# Altium project Ilk Proje.PrjPcb (part 3 of 3)

## Sheet Sensor Board.SchDoc: Wireless Security
size A3; Date: 30.06.2023; CompanyName: Freelance; Engineer: Berke Tırpan; SheetNumber: 5; SheetTotal: 5; PageSize: A3
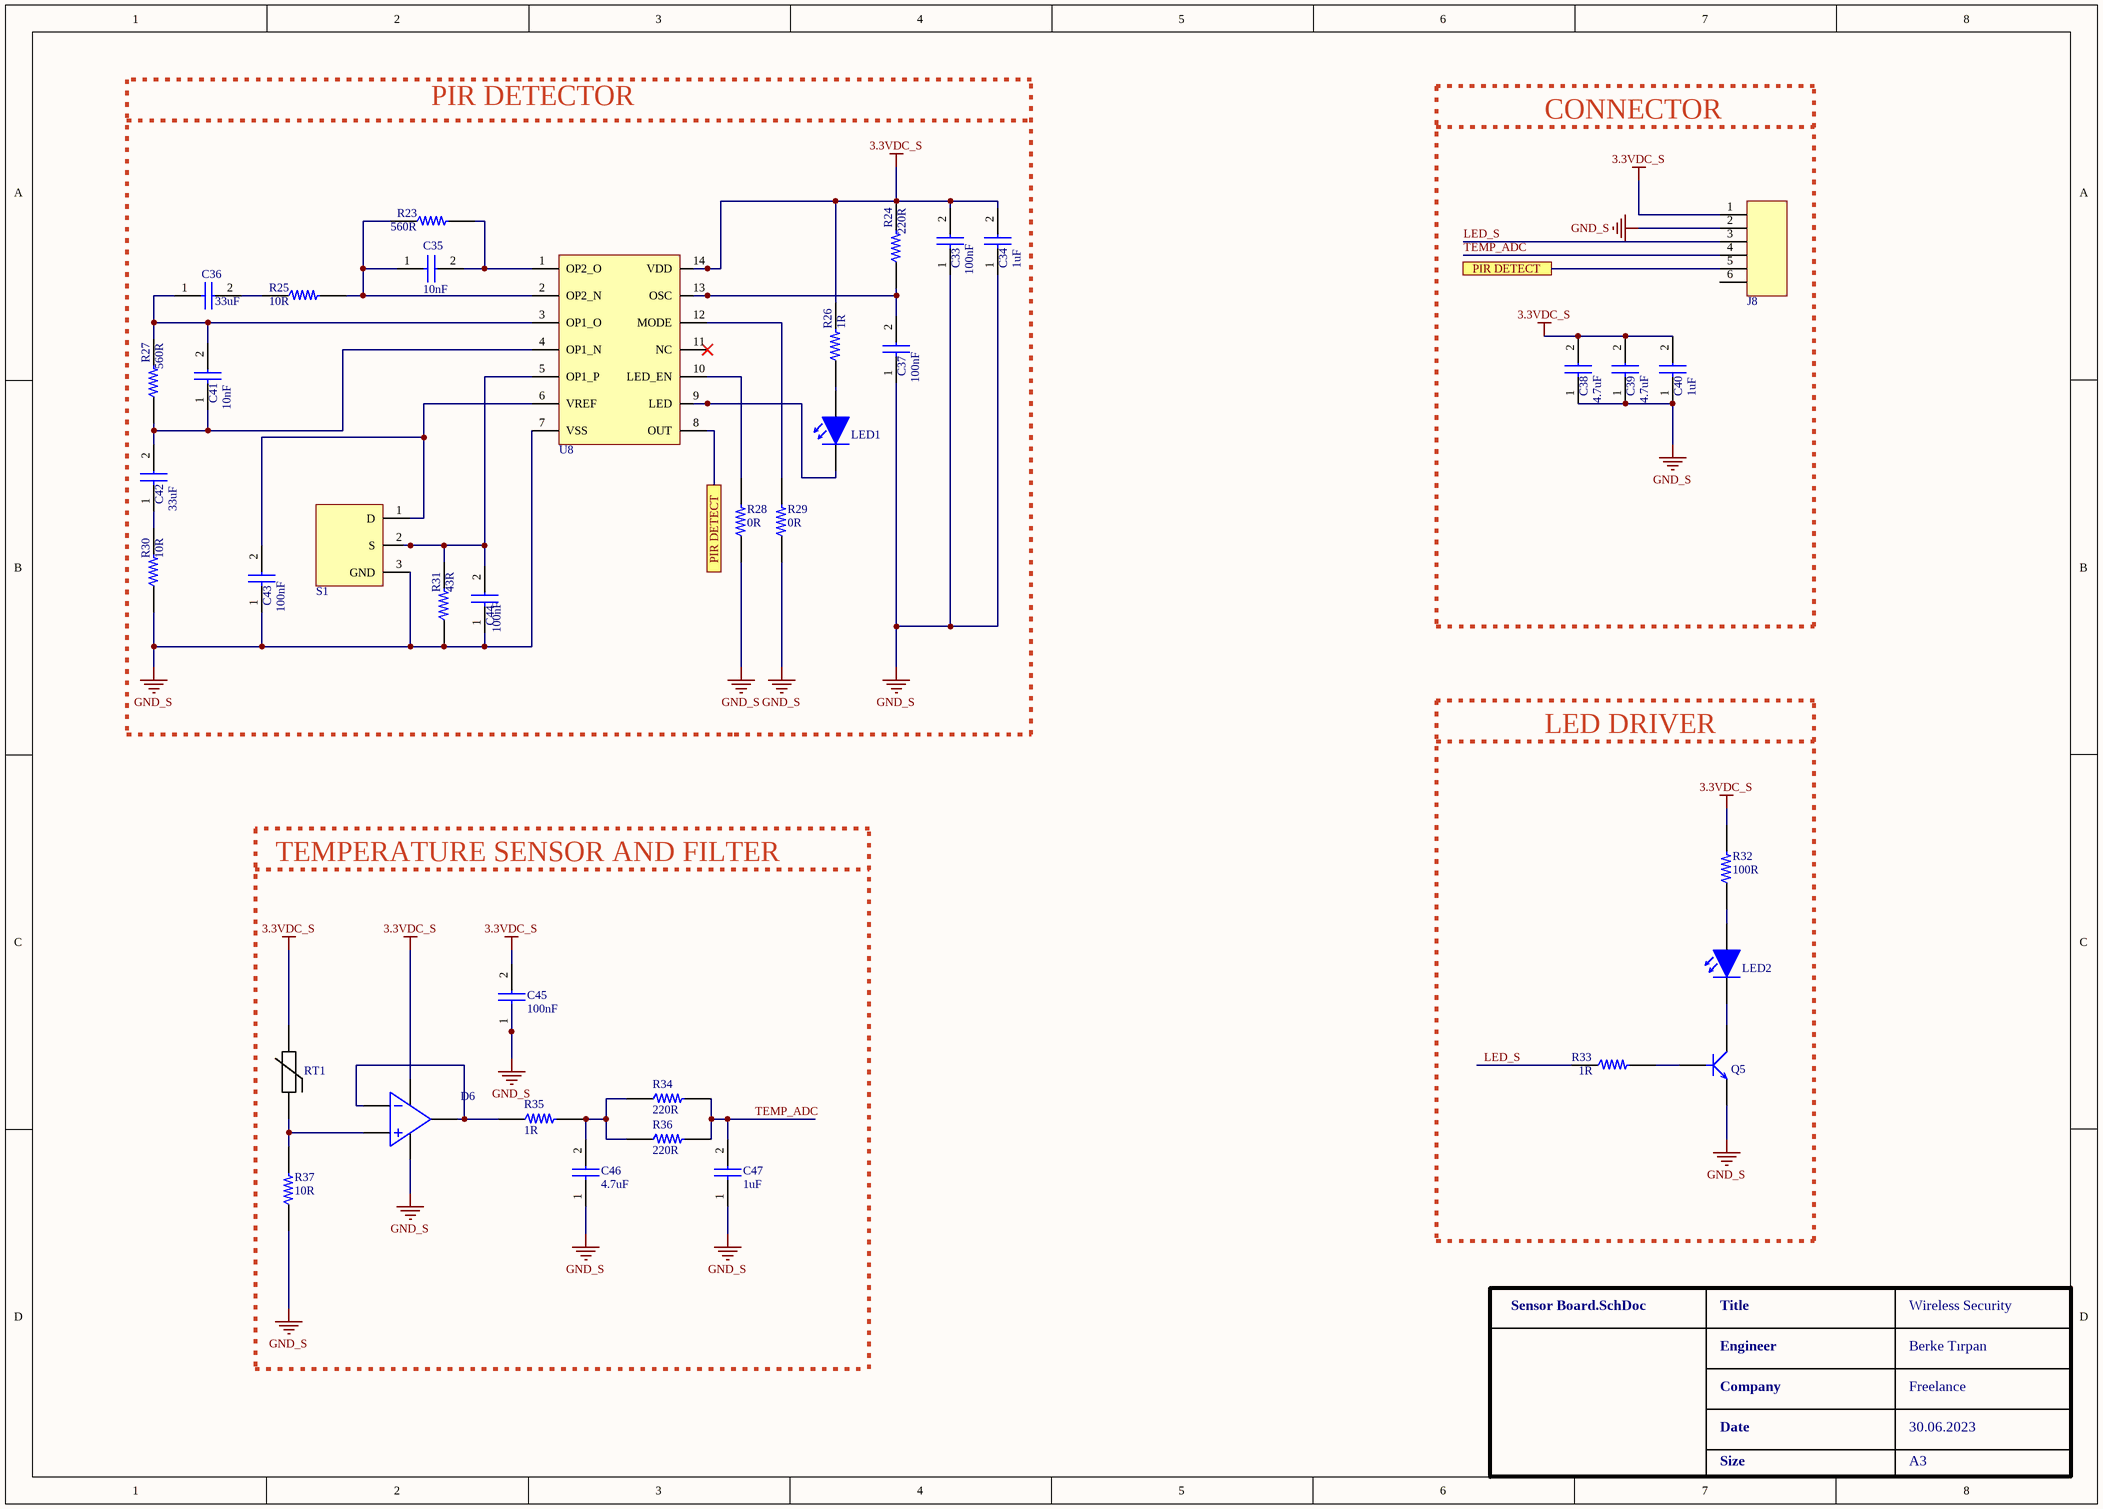
[diagram p4: Sensor Board.SchDoc]

### Parts
C33  Capacitance: 100nF  [CAP_0603]  (hidden comment: C0603C104K5RACTU)
C34  Capacitance: 1uF  [CAP_0805]  (hidden comment: CAP CER 1uF 0805)
C35  Capacitance: 10nF  [CAP_0603]  (hidden comment: CAP CER 10nF 0603)
C36  Capacitance: 33uF  [CAP_1206]  (hidden comment: C3216X5R1E336M160AC)
C37  Capacitance: 100nF  [CAP_0603]  (hidden comment: C0603C104K5RACTU)
C38  Capacitance: 4.7uF  [CAP_0805]  (hidden comment: CAP_CER_4,7UF_0805)
C39  Capacitance: 4.7uF  [CAP_0805]  (hidden comment: CAP_CER_4,7UF_0805)
C40  Capacitance: 1uF  [CAP_0805]  (hidden comment: CAP CER 1uF 0805)
C41  Capacitance: 10nF  [CAP_0603]  (hidden comment: CAP CER 10nF 0603)
C42  Capacitance: 33uF  [CAP_1206]  (hidden comment: C3216X5R1E336M160AC)
C43  Capacitance: 100nF  [CAP_0603]  (hidden comment: C0603C104K5RACTU)
C44  Capacitance: 100nF  [CAP_0603]  (hidden comment: C0603C104K5RACTU)
C45  Capacitance: 100nF  [CAP_0603]  (hidden comment: C0603C104K5RACTU)
C46  Capacitance: 4.7uF  [CAP_0805]  (hidden comment: CAP_CER_4,7UF_0805)
C47  Capacitance: 1uF  [CAP_0805]  (hidden comment: CAP CER 1uF 0805)
D6  OPA314AIDBVR  [SOT23-5]  (value not drawn)
J8  64800611622  [64800611622]  (value not drawn)
LED1  LTST-C171GKT  [LED_GREEN_0805]  (value not drawn)
LED2  LH R974-LP1  [LED_RED_0805]  (value not drawn)
Q5  MMBT3904-7-F  [SOT23-F]  (value not drawn)
R23  Resistance: 560R  [RES_0603]  (hidden comment: RC0603JR-07560KL)
R24  Resistance: 220R  [RES_0603]  (hidden comment: RC0603JR-07220KL)
R25  Resistance: 10R  [RES_0603]  (hidden comment: RC0603FR-0710KL)
R26  Resistance: 1R  [RES_0603]  (hidden comment: RT0603BRD071KL)
R27  Resistance: 560R  [RES_0603]  (hidden comment: RC0603JR-07560KL)
R28  Resistance: 0R  [RES_0603]  (hidden comment: RC0603JR-070RL)
R29  Resistance: 0R  [RES_0603]  (hidden comment: RC0603JR-070RL)
R30  Resistance: 10R  [RES_0603]  (hidden comment: RC0603FR-0710KL)
R31  Resistance: 43R  [RES_0603]  (hidden comment: RC0603JR-0743KL)
R32  Resistance: 100R  [RES_0603]  (hidden comment: RC0603FR-07100KL)
R33  Resistance: 1R  [RES_0603]  (hidden comment: RT0603BRD071KL)
R34  Resistance: 220R  [RES_0603]  (hidden comment: RC0603JR-07220KL)
R35  Resistance: 1R  [RES_0603]  (hidden comment: RT0603BRD071KL)
R36  Resistance: 220R  [RES_0603]  (hidden comment: RC0603JR-07220KL)
R37  Resistance: 10R  [RES_0603]  (hidden comment: RC0603FR-0710KL)
RT1  TFPT1206L1002FM  [RES_1206]  (value not drawn)
S1  LHI 878/3902  [LHI 878]  (value not drawn)
U8  NCS36000DRG  [SOIC14]  (value not drawn)

### Blocks framed on the sheet
PIR DETECTOR: C33-C37 C41-C44 LED1 R23-R31 S1 U8
CONNECTOR: C38-C40 J8
LED DRIVER: LED2 Q5 R32 R33

### Ports
PIR DETECT (see Sensor Board[3B]), PIR DETECT (see Sensor Board[6A])

### Nets
3.3VDC_S: C33.2 C34.2 C38.2 C39.2 C40.2 C45.2 D6.5 J8.1 R24.2 R26.2 R32.2 RT1.2 U8.14(VDD)
GND_S: C33.1 C34.1 C37.1 C38.1 C39.1 C40.1 C43.1 C44.1 C45.1 C46.1 C47.1 D6.2 J8.2 Q5.2(E) R28.1 R29.1 R30.1 R31.1 R37.1 S1.3(GND) U8.7(VSS)
LED_S: J8.3 R33.1
TEMP_ADC: C47.2 J8.4 R34.2 R36.2
NetC35_1: C35.1 R23.1 R25.2 U8.2(OP2_N)
NetC35_2: C35.2 R23.2 U8.1(OP2_O)
NetC36_1: C36.1 C41.2 R27.2 U8.3(OP1_O)
NetC36_2: C36.2 R25.1
NetC37_2: C37.2 R24.1 U8.13(OSC)
NetC41_1: C41.1 C42.2 R27.1 U8.4(OP1_N)
NetC42_1: C42.1 R30.2
NetC43_2: C43.2 S1.1(D) U8.6(VREF)
NetC44_2: C44.2 R31.2 S1.2(S) U8.5(OP1_P)
NetC46_2: C46.2 R34.1 R35.2 R36.1
NetD6_1: D6.1 D6.4 R35.1
NetD6_3: D6.3 R37.2 RT1.1
NetJ8_5: J8.5 U8.8(OUT) ; port PIR DETECT
NetLED1_1: LED1.1 U8.9(LED)
NetLED1_2: LED1.2 R26.1
NetLED2_1: LED2.1 Q5.3(C)
NetLED2_2: LED2.2 R32.1
NetQ5_1: Q5.1(B) R33.2
NetR28_2: R28.2 U8.10(LED_EN)
NetR29_2: R29.2 U8.12(MODE)

Not connected (* = marked no-connect by the designer): J8 6; U8 11(NC)*

### Notes on the sheet
- TEMPERATURE SENSOR AND FILTER
- Title
- Engineer
- Company
- Date
- Size

### Library data of the parts
C33 C37 C43-C45 = CAP CER 100nF 0603: Multilayer Ceramic Capacitors (MLCC) - SMD/SMT 50volts 0.1uF X7R 10%; Manufacturer: KEMET; Voltage: 50V; Desinged by: BERKE; Supplier 1: Digi-Key; Manufacturer Part Number: C0603C104K5RACTU; RoHS: Yes; Category: Ceramic Capacitors; Stock 1: 10147790; Pricing 1: 1=0,11, 10=0,078, 50=0,0424, 100=0,0346, 500=0,02474, 1000=0,01944 (USD); Mount: Surface Mount; Case/Package: 0603; Min Operating Temperature: -55°C; Max Operating Temperature: 125°C; Tolerance: 10%; Packaging: Tape and Reel; Dielectric: X7R; Series: SMD Comm X7R; Voltage Rating: 50V; Length: 0.063inch; Width: 0.031inch; Thickness: 0.034inch; RoHS Compliant: Yes; Supplier Part Number 1: 399-C0603C104K5RAC7867CT-ND
C34 C40 C47 = CAP CER 1uF 0805: CAP CER 1UF 50V X7R %10 0805; Manufacturer: Samsung; Manufacturer Part Number: CL21B105KBFNNNE; Desinged by: BERKE; Tolerance: 10%; Supplier 1: Digi-Key; RoHS: Yes; Category: Ceramic Capacitors; Stock 1: 84626; Pricing 1: 1=0,11, 10=0,079, 50=0,045, 100=0,0373, 500=0,02616, 1000=0,02165 (USD); Mount: Surface Mount; Case/Package: 0805; Case Code (Metric): 2012; Case Code (Imperial): 0805; Min Operating Temperature: -55°C; Max Operating Temperature: 125°C; Packaging: Tape and Reel; Package Quantity: 1; Voltage Rating: 50V; Dielectric: X7R; Voltage: 50V; Series: CL; Construction: Flat; Length: 2mm; Width: 0.049inch; Height: 1.25mm; Thickness: 0.053inch; Depth: 1.25mm; Radiation Hardening: No; RoHS Compliant: Yes; ComponentLink1URL: https://datasheet.ciiva.com/25800/cl21b105kbfnnne-25800291.pdf?src-supplier=Digi-Key; ComponentLink1Description: https://datasheet.ciiva.com/25800/cl21b105kbfnnne-25800291.pdf?src-supplier=Digi-Key; Supplier Part Number 1: 1276-1029-1-ND
C35 C41 = CAP CER 10nF 0603: Multilayer Ceramic Capacitor, 0.01 F, 10%, X7R, 16 V, 0603 [1608 Metric] RoHS Compliant: Yes; Manufacturer: Walsin Technologies; Manufacturer Part Number: 0603B103K160CT; Desinged by: BERKE; Voltage Rating: 16V; Supplier 1: Digi-Key; RoHS: Yes; Category: Ceramic Capacitors; Stock 1: 54105; Pricing 1: 1=0,1, 10=0,033, 50=0,0182, 100=0,0148, 500=0,0106, 1000=0,00833 (USD); Case Code (Metric): 1608; Case Code (Imperial): 0603; Min Operating Temperature: -55°C; Max Operating Temperature: 125°C; Tolerance: 10%; Packaging: Tape and Reel; Dielectric: X7R; Voltage Rating (DC): 16V; RoHS Compliant: Yes; Reach SVHC Compliant: Unknown; ComponentLink1URL: http://www.farnell.com/datasheets/1958513.pdf?src-supplier=Farnell; ComponentLink1Description: http://www.farnell.com/datasheets/1958513.pdf?src-supplier=Farnell; ComponentLink2URL: http://www.farnell.com/datasheets/1958513.pdf?src-supplier=Element14; ComponentLink2Description: http://www.farnell.com/datasheets/1958513.pdf?src-supplier=Element14; ComponentLink3URL: http://www.passivecomponent.com/wp-content/uploads/2018/10/MLCC.pdf?src-supplier=Digi-Key; ComponentLink3Description: http://www.passivecomponent.com/wp-content/uploads/2018/10/MLCC.pdf?src-supplier=Digi-Key; Supplier Part Number 1: 1292-1384-1-ND
C36 C42 = CAP CER 33uF 1206: C Series 1206 33 uF 25 V ±20 % Tolerance X5R SMT Multilayer Ceramic Capacitor; Manufacturer: TDK; Desinged by: BERKE; Voltage Rating: 25V; Tolerance: 20%; Supplier 1: Digi-Key; Manufacturer Part Number: C3216X5R1E336M160AC; RoHS: Yes; Category: Ceramic Capacitors; Stock 1: 254609; Pricing 1: 1=0,96, 10=0,758, 50=0,6564, 100=0,5681, 500=0,42924, 1000=0,37875 (USD); Mount: Surface Mount; Case/Package: 1206; Case Code (Metric): 3216; Case Code (Imperial): 1206; Weight: 0.000571oz; Dielectric Material: Ceramic; Min Operating Temperature: -55°C; Max Operating Temperature: 85°C; Packaging: Tape and Reel; Termination: SMD/SMT; Series: C; Package Quantity: 1; Voltage Rating (DC): 25V; Dielectric: X5R; Length: 3.2mm; Width: 0.063inch; Depth: 1.6mm; Thickness: 1.6mm; Reach SVHC Compliant: No; Lead Free: Lead Free; RoHS Compliant: Yes; ComponentLink1URL: https://datasheet.ciiva.com/24216/c3216x5r1e336m160ac-265051-24216512.pdf?src-supplier=Mouser; ComponentLink1Description: https://datasheet.ciiva.com/24216/c3216x5r1e336m160ac-265051-24216512.pdf?src-supplier=Mouser; ComponentLink2URL: https://datasheet.ciiva.com/6285/tdkmlcccaprange-6285278.pdf?src-supplier=Digi-Key; ComponentLink2Description: https://datasheet.ciiva.com/6285/tdkmlcccaprange-6285278.pdf?src-supplier=Digi-Key; Supplier Part Number 1: 445-8046-1-ND
C38 C39 C46 = CAP_CER_4,7UF_0805: CAP CER 4.7UF 25V %10 0805; Manufacturer: Samsung; Manufacturer Part Number: CL21A475KAQNNNE; Tolerance: 10%; Dielectric: X5R; Desinged by: BERKE; Supplier 1: Digi-Key; RoHS: Yes; Category: Ceramic Capacitors; Stock 1: 4065249; Pricing 1: 1=0,1, 10=0,073, 50=0,0414, 100=0,0344, 500=0,02408, 1000=0,01994 (USD); Mount: Surface Mount; Case/Package: 0805; Case Code (Metric): 2012; Case Code (Imperial): 0805; Min Operating Temperature: -55°C; Max Operating Temperature: 85°C; Packaging: Tape and Reel; Voltage Rating: 25V; Voltage Rating (DC): 25V; Series: CL; Construction: Flat; Length: 2mm; Height: 1.25mm; Depth: 1.25mm; Radiation Hardening: No; Lead Free: Lead Free; RoHS Compliant: Yes; ComponentLink1URL: https://datasheet.ciiva.com/25798/cl21a475kaqnnne-25798882.pdf?src-supplier=Digi-Key; ComponentLink1Description: https://datasheet.ciiva.com/25798/cl21a475kaqnnne-25798882.pdf?src-supplier=Digi-Key; Supplier Part Number 1: 1276-1244-1-ND
D6 = OPA314: IC OPAMP GP 3MHZ RRO SOT23-5; Manufacturer: Texas Instruments; Min Supply Voltage: 1.8V; Max Supply Voltage: 5.5V; Min Dual Supply Voltage: 900mV; Max Dual Supply Voltage: 2.75V; Voltage Gain: 128dB; Common Mode Rejection Ratio: 75dB; Output Current: 20mA; Number of Channels: 1; Slew Rate: 1.5V/µs; Max I/O Voltage: 2.5mV; Input Bias Current: 10pA; Operating Supply Current: 150uA; Power Supply Rejection Ratio (PSRR): 78dB; Amplifier Type: GENERAL PURPOSE; Desinged by: BERKE; Supplier 1: Digi-Key; Manufacturer Part Number: OPA314AIDBVR; RoHS: Yes; Category: Amplifiers - Op Amps, Buffer, Instrumentation; Stock 1: 1044; Pricing 1: 1=1,18, 10=1,054, 25=1,0008, 100=0,822, 250=0,76844, 500=0,67908, 1000=0,53612 (USD); Case/Package: SOT-23-5; Number of Pins: 5; Min Operating Temperature: -40°C; Max Operating Temperature: 125°C; Gain Bandwidth Product: 3MHz; Package Quantity: 1; Packaging: Tape and Reel; Unity Gain Bandwidth Product: 3MHz; Nominal Gain Bandwidth Product: 3MHz; Input Offset Voltage (Vos): 2.5mV; Number of Circuits: 1; Output Current per Channel: 20mA; Number of Elements: 1; Supply Current: 150uA; Series: -; Technology: CMOS; Radiation Hardening: No; Lead Free: Lead Free; RoHS Compliant: Yes; ComponentLink1URL: https://datasheet.ciiva.com/29638/opa314-29638827.pdf?src-supplier=Digi-Key; ComponentLink1Description: https://datasheet.ciiva.com/29638/opa314-29638827.pdf?src-supplier=Digi-Key; ComponentLink2URL: https://datasheet.ciiva.com/14462/opa2314-14462006.pdf?src-supplier=Avnet; ComponentLink2Description: https://datasheet.ciiva.com/14462/opa2314-14462006.pdf?src-supplier=Avnet; ComponentLink3URL: https://datasheet.ciiva.com/14456/opa2314-14456281.pdf?src-supplier=Avnet; ComponentLink3Description: https://datasheet.ciiva.com/14456/opa2314-14456281.pdf?src-supplier=Avnet; Supplier Part Number 1: 296-36699-1-ND
J8 = 64800611622_conn_6pin: WR-WTB Wire-to-Board Connectors 6PIN 1.50 mm; Manufacturer: Wurth Electronics; Desinged by: BERKE; Supplier 1: Digi-Key; Manufacturer Part Number: 64800611622; RoHS: No; Category: Uncategorized; Stock 1: 929; Pricing 1: 1=0,42, 50=0,406, 100=0,384, 250=0,361, 500=0,339 (USD); Supplier Part Number 1: 732-64800611622-ND
LED1 = LED GREEN 0805: Green 569nm LED Indication - Discrete 2.1V 0805 (2012 Metric); Manufacturer: Vishay Lite-On; Lens Color: Colorless; Viewing Angle: 130°; Lens Style: Flat,Diffused,Colorless,Rectangular,Clear; Luminous Intensity: 12mcd; Forward Current: 30mA; Power Rating: 100mW; Test Current: 10mA; Lens Transparency: Clear; Number of Elements: 1; Wavelength: 585nm; Reverse Voltage: 5V; Lens Size: 1.25mm; Desinged by: BERKE; Supplier 1: Digi-Key; Manufacturer Part Number: LTST-C171GKT; RoHS: Yes; Category: LEDs; Stock 1: 207659; Pricing 1: 1=0,26, 10=0,143, 100=0,0663, 500=0,0612, 1000=0,04794 (USD); Mount: Surface Mount; Case/Package: 0805; Number of Pins: 2; Color: Green; Case Code (Metric): 2012; Case Code (Imperial): 0805; Min Operating Temperature: -55°C; Max Operating Temperature: 85°C; Package Quantity: 3000; Packaging: Tape and Reel; Forward Voltage: 2.1V; Illumination Color: Green; Dominant Wavelength: 569nm; Power Dissipation: 100mW; Number of LEDs: 1; Series: -; Length: 2mm; Width: 1.25mm; Height: 0.9mm; Depth: 1.25mm; Radiation Hardening: No; Lead Free: Lead Free; RoHS Compliant: Yes; ComponentLink1URL: https://datasheet.ciiva.com/11773/0900766b80dc0296-11773991.pdf?src-supplier=Rs; ComponentLink1Description: https://datasheet.ciiva.com/11773/0900766b80dc0296-11773991.pdf?src-supplier=Rs; ComponentLink2URL: https://datasheet.ciiva.com/2110/ltst-c171gkt-2110000.pdf?src-supplier=Digi-Key; ComponentLink2Description: https://datasheet.ciiva.com/2110/ltst-c171gkt-2110000.pdf?src-supplier=Digi-Key; ComponentLink3URL: https://datasheet.ciiva.com/12400/lite-on-ltst-c171gkt-190133-12400647.pdf?src-supplier=Mouser; ComponentLink3Description: https://datasheet.ciiva.com/12400/lite-on-ltst-c171gkt-190133-12400647.pdf?src-supplier=Mouser; ComponentLink4URL: https://datasheet.ciiva.com/2110/ltst-c171gkt-2110001.pdf?src-supplier=Digi-Key; ComponentLink4Description: https://datasheet.ciiva.com/2110/ltst-c171gkt-2110001.pdf?src-supplier=Digi-Key; ComponentLink5URL: https://datasheet.ciiva.com/2110/ltst-c171gkt-2110002.pdf?src-supplier=Digi-Key; ComponentLink5Description: https://datasheet.ciiva.com/2110/ltst-c171gkt-2110002.pdf?src-supplier=Digi-Key; ComponentLink6URL: https://datasheet.ciiva.com/16396/ltst-c171gkt-16396549.pdf?src-supplier=Future+Electronics; ComponentLink6Description: https://datasheet.ciiva.com/16396/ltst-c171gkt-16396549.pdf?src-supplier=Future+Electronics; Supplier Part Number 1: 160-1423-1-ND
LED2 = LED RED 0805: LED Uni-Color Hyper Red 660nm 2-Pin Chip 0805(2012Metric) T/R; Mfr: ams-OSRAN USA INC.; Desinged by: BERKE; Lens Transparency: Diffused; Lens Color: White; Configuration: Standard; Product Status: Obsolete; Base Product Number: LHR974; Wavelength - Dominant: 645nm; Viewing Angle: 160; Current - Test: 20mA; Millicandela Rating: 41mcd; Lens Style: Rectangle with Flat Top; Lens Size: 1.30mm x 1.25mm; Voltage - Forward (Vf) (Typ): 1.8V; Color: Red; Package: Tape & Reel (TR); Series: CHIPLED 0805; Height (Max): 0.90mm; Size / Dimension: 2.00mm L x 1.25mm W; Supplier Device Package: 0805; Package / Case: 0805 (2012 Metric); Features: -; Wavelength - Peak: 660nm; Mounting Type: Surface Mount
Q5 = MMBT3904-7-F: NPN Ic=200mA Vceo=40V hfe=100~300 fT=310MHz P=300mW SOT-23; Manufacturer: Diodes Zetex; Desinged by: BERKE; Max Power Dissipation: 300mW; Collector Emitter Voltage (VCEO): 40V; Max Collector Current: 200mA; Collector Base Voltage (VCBO): 60V; Power Dissipation: 350mW; Frequency: 300MHz; hFE Min: 100; Number of Elements: 1; Emitter Base Voltage (VEBO): 6V; Collector Emitter Saturation Voltage: 300mV; Supplier 1: Digi-Key; Manufacturer Part Number: MMBT3904-7-F; RoHS: Yes; Category: BJTs; Stock 1: 6383011; Pricing 1: 1=0,12, 10=0,11, 100=0,0601, 500=0,03696, 1000=0,0252 (USD); Mount: Surface Mount; Case/Package: SOT-23; Number of Pins: 3; Weight: 0.000282oz; Min Operating Temperature: -55°C; Max Operating Temperature: 150°C; Polarity: NPN; Packaging: Tape and Reel; Package Quantity: 3000; Transition Frequency: 300MHz; Collector Emitter Breakdown Voltage: 40V; Max Breakdown Voltage: 40V; Continuous Collector Current: 200mA; Max Frequency: 300MHz; Gain Bandwidth Product: 300MHz; Voltage Rating (DC): 40V; Series: Automotive, AEC-Q101; Collector-emitter Voltage-Max: 300mV; Length: 3.05mm; Width: 1.4mm; Height: 1mm; Radiation Hardening: No; Reach SVHC Compliant: No; Lead Free: Lead Free; RoHS Compliant: Yes; ComponentLink1URL: https://datasheet.ciiva.com/11201/ds30036-11201778.pdf?src-supplier=Avnet; ComponentLink1Description: https://datasheet.ciiva.com/11201/ds30036-11201778.pdf?src-supplier=Avnet; ComponentLink2URL: https://datasheet.ciiva.com/15138/getdatasheetpartid-53265-15138780.pdf?src-supplier=Verical; ComponentLink2Description: https://datasheet.ciiva.com/15138/getdatasheetpartid-53265-15138780.pdf?src-supplier=Verical; ComponentLink3URL: https://datasheet.ciiva.com/22711/1915516-22711750.pdf?src-supplier=Element14; ComponentLink3Description: https://datasheet.ciiva.com/22711/1915516-22711750.pdf?src-supplier=Element14; ComponentLink4URL: https://datasheet.ciiva.com/11198/ds30036-11198999.pdf?src-supplier=Avnet; ComponentLink4Description: https://datasheet.ciiva.com/11198/ds30036-11198999.pdf?src-supplier=Avnet; ComponentLink5URL: https://datasheet.ciiva.com/6361/ds30036-6361256.pdf?src-supplier=Digi-Key; ComponentLink5Description: https://datasheet.ciiva.com/6361/ds30036-6361256.pdf?src-supplier=Digi-Key; ComponentLink6URL: https://datasheet.ciiva.com/6361/ds30036-6361254.pdf?src-supplier=Digi-Key; ComponentLink6Description: https://datasheet.ciiva.com/6361/ds30036-6361254.pdf?src-supplier=Digi-Key; Supplier Part Number 1: MMBT3904-FDICT-ND
R23 R27 = RES 560K OHM 0603: Res Thick Film 0603 560K Ohm 5% 0.1W(1/10W) ±100ppm/C Molded SMD Paper T/R; Manufacturer: Yageo; Desinged by: BERKE; Power Rating: 100mW; Voltage Rating: 75V; Voltage Rating (DC): 50V; Temperature Coefficient: 100ppm/°C; Supplier 1: Digi-Key; Manufacturer Part Number: RC0603JR-07560KL; RoHS: Yes; Category: Chip SMD Resistors; Stock 1: 503311; Pricing 1: 1=0,1, 10=0,014, 50=0,0088, 100=0,0073, 500=0,00486, 1000=0,00415 (USD); Case/Package: 0603; Number of Pins: 2; Case Code (Metric): 1608; Case Code (Imperial): 0603; Weight: 7.1E-05oz; Min Operating Temperature: -55°C; Max Operating Temperature: 155°C; Package Quantity: 1; Tolerance: 5%; Packaging: Tape and Reel; Resistor Type: Thick Film; Number of Terminations: 2; Termination: SMD/SMT; Max Power Dissipation: 100mW; Working Voltage: 75V; Features: Moisture Resistant; Series: RC; Resistance Tolerance: 5%; Technology: THICK FILM; Length: 0.063inch; Width: 0.8mm; Height: 0.022inch; Lead Free: Lead Free; RoHS Compliant: Yes; Reach SVHC Compliant: Unknown; ComponentLink1URL: https://datasheet.ciiva.com/2453/pyu-r-int-thick-7-2453056.pdf?src-supplier=Digi-Key; ComponentLink1Description: https://datasheet.ciiva.com/2453/pyu-r-int-thick-7-2453056.pdf?src-supplier=Digi-Key; ComponentLink2URL: https://datasheet.ciiva.com/2453/pyu-r-int-thick-7-2453057.pdf?src-supplier=Digi-Key; ComponentLink2Description: https://datasheet.ciiva.com/2453/pyu-r-int-thick-7-2453057.pdf?src-supplier=Digi-Key; ComponentLink3URL: https://datasheet.ciiva.com/2453/pyu-r-int-thick-7-2453055.pdf?src-supplier=Digi-Key; ComponentLink3Description: https://datasheet.ciiva.com/2453/pyu-r-int-thick-7-2453055.pdf?src-supplier=Digi-Key; Supplier Part Number 1: 311-560KGRCT-ND
R24 R34 R36 = RES 220K OHM 0603: Res Thick Film 0603 220K Ohm 5% 0.1W(1/10W) ±100ppm/C Pad SMD T/R; Manufacturer: Yageo; Desinged by: BERKE; Temperature Coefficient: 100ppm/°C; Voltage Rating (DC): 50V; Power Rating: 100mW; Supplier 1: Digi-Key; Manufacturer Part Number: RC0603JR-07220KL; RoHS: Yes; Category: Chip SMD Resistors; Stock 1: 1082518; Pricing 1: 1=0,1, 10=0,014, 50=0,0088, 100=0,0073, 500=0,00486, 1000=0,00415 (USD); Case/Package: 0603; Number of Pins: 2; Case Code (Imperial): 0603; Case Code (Metric): 1608; Size Code: 0603; Min Operating Temperature: -55°C; Max Operating Temperature: 155°C; Resistor Type: Thick Film; Tolerance: 5%; Packaging: Tape and Reel; Voltage Rating: 50V; Package Quantity: 1; Termination: SMD/SMT; Number of Terminations: 2; Max Power Dissipation: 100mW; Features: Moisture Resistant; Series: RC; Construction: Rectangular; Resistance Tolerance: 5%; Length: 0.063inch; Width: 0.031inch; Height: 0.022inch; Depth: 0.8mm; Reach SVHC Compliant: No; Lead Free: Lead Free; RoHS Compliant: Yes; Military Standard: Not; ComponentLink1URL: https://datasheet.ciiva.com/2452/pyu-r-int-thick-7-2452925.pdf?src-supplier=Digi-Key; ComponentLink1Description: https://datasheet.ciiva.com/2452/pyu-r-int-thick-7-2452925.pdf?src-supplier=Digi-Key; ComponentLink2URL: https://datasheet.ciiva.com/2452/pyu-r-int-thick-7-2452923.pdf?src-supplier=Digi-Key; ComponentLink2Description: https://datasheet.ciiva.com/2452/pyu-r-int-thick-7-2452923.pdf?src-supplier=Digi-Key; ComponentLink3URL: https://datasheet.ciiva.com/2452/pyu-r-int-thick-7-2452924.pdf?src-supplier=Digi-Key; ComponentLink3Description: https://datasheet.ciiva.com/2452/pyu-r-int-thick-7-2452924.pdf?src-supplier=Digi-Key; Supplier Part Number 1: 311-220KGRCT-ND
R25 R30 R37 = RES 10K OHM 0603: RES SMD 10K OHM 1% 1/10W 0603; Manufacturer: Yageo; Temperature Coefficient: 100ppm/°C; Voltage Rating (DC): 50V; Power Rating: 100mW; Voltage Rating: 75V; Desinged by: BERKE; Supplier 1: Digi-Key; Manufacturer Part Number: RC0603FR-0710KL; RoHS: Yes; Category: Chip SMD Resistors; Stock 1: 31631181; Pricing 1: 1=0,1, 10=0,019, 50=0,0114, 100=0,0094, 500=0,00628, 1000=0,00537 (USD); Case/Package: 0603; Number of Pins: 2; Case Code (Imperial): 0603; Case Code (Metric): 1608; Weight: 7.1E-05oz; Size Code: 0603; Min Operating Temperature: -55°C; Max Operating Temperature: 155°C; Tolerance: 1%; Resistor Type: Thick Film; Packaging: Tape and Reel; Termination: SMD/SMT; Features: Moisture Resistant; Series: RC; Max Power Dissipation: 100mW; Number of Terminations: 2; Resistance Tolerance: 1%; Construction: Rectangular; Length: 1.6mm; Width: 0.8mm; Height: 0.45mm; Depth: 0.8mm; Lead Pitch: 0.3mm; Reach SVHC Compliant: No; Lead Free: Lead Free; Military Standard: Not; RoHS Compliant: Yes; ComponentLink1URL: https://datasheet.ciiva.com/7660/38590-7660789.pdf?src-supplier=Element14; ComponentLink1Description: https://datasheet.ciiva.com/7660/38590-7660789.pdf?src-supplier=Element14; ComponentLink2URL: https://datasheet.ciiva.com/7983/443971-7983596.pdf?src-supplier=Element14; ComponentLink2Description: https://datasheet.ciiva.com/7983/443971-7983596.pdf?src-supplier=Element14; ComponentLink3URL: https://datasheet.ciiva.com/22747/443971-22747519.pdf?src-supplier=Element14; ComponentLink3Description: https://datasheet.ciiva.com/22747/443971-22747519.pdf?src-supplier=Element14; ComponentLink4URL: https://datasheet.ciiva.com/46440/1868787-46440891.pdf?src-supplier=Element14; ComponentLink4Description: https://datasheet.ciiva.com/46440/1868787-46440891.pdf?src-supplier=Element14; ComponentLink5URL: https://datasheet.ciiva.com/7746/1738695-7746239.pdf?src-supplier=Element14; ComponentLink5Description: https://datasheet.ciiva.com/7746/1738695-7746239.pdf?src-supplier=Element14; ComponentLink6URL: https://datasheet.ciiva.com/15189/getdatasheetpartid-409289-15189591.pdf?src-supplier=Verical; ComponentLink6Description: https://datasheet.ciiva.com/15189/getdatasheetpartid-409289-15189591.pdf?src-supplier=Verical; Supplier Part Number 1: 311-10.0KHRCT-ND
R26 R33 R35 = RES 1K OHM 0603: High Precision-High Stability Chip Resistor Thin Film 0603 1kOhm 0.1% Paper T/R; Manufacturer: Yageo; Desinged by: BERKE; Power Rating: 100mW; Voltage Rating: 75V; Temperature Coefficient: 25ppm/°C; Voltage Rating (DC): 50V; Supplier 1: Digi-Key; Manufacturer Part Number: RT0603BRD071KL; RoHS: Yes; Category: Chip SMD Resistors; Stock 1: 114977; Pricing 1: 1=0,34, 10=0,288, 100=0,1126, 500=0,06812, 1000=0,04716, 2500=0,04322 (USD); Mount: Surface Mount; Case/Package: 0603; Case Code (Metric): 1608; Case Code (Imperial): 0603; Contact Plating: Tin,Lead; Size Code: 0603; Min Operating Temperature: -55°C; Max Operating Temperature: 155°C; Package Quantity: 5000; Packaging: Tape and Reel; Termination: SMD/SMT; Series: RT; Technology: THIN FILM; Number of Terminations: 2; Max Power Dissipation: 100mW; Features: Moisture Resistant; Length: 0.063inch; Width: 0.031inch; Height: 0.022inch; Depth: 0.8mm; RoHS Compliant: Yes; Lead Free: Lead Free; ComponentLink1URL: https://datasheet.ciiva.com/5624/pyu-rt-1-to-0-05-rohs-l-4-5624759.pdf?src-supplier=Mouser; ComponentLink1Description: https://datasheet.ciiva.com/5624/pyu-rt-1-to-0-05-rohs-l-4-5624759.pdf?src-supplier=Mouser; ComponentLink2URL: https://datasheet.ciiva.com/29718/pyu-rt-1-to-0-05-rohs-l-4-29718010.pdf?src-supplier=Digi-Key; ComponentLink2Description: https://datasheet.ciiva.com/29718/pyu-rt-1-to-0-05-rohs-l-4-29718010.pdf?src-supplier=Digi-Key; Supplier Part Number 1: YAG1237CT-ND
R28 R29 = RES 0 OHM 0603: RES SMD 0 OHM JUMPER 1/10W 0603; Manufacturer: Yageo; Tolerance: 1%; Power Rating: 100mW; Voltage Rating (DC): 50V; Temperature Coefficient: 200ppm/°C; Resistance Tolerance: 5%; Desinged by: BERKE; Supplier 1: Digi-Key; Manufacturer Part Number: RC0603JR-070RL; RoHS: Yes; Category: Chip SMD Resistors; Stock 1: 7452176; Pricing 1: 1=0,1, 10=0,016, 25=0,0112, 50=0,0086, 100=0,0063, 250=0,0048, 500=0,00386, 1000=0,00284 (USD); Case/Package: 0603; Number of Pins: 2; Contact Plating: Tin,Matte; Case Code (Imperial): 0603; Case Code (Metric): 1608; Size Code: 0603; Min Operating Temperature: -55°C; Resistor Type: Thick Film; Packaging: Tape and Reel; Termination: SMD/SMT; Series: RC; Technology: THICK FILM; Package Quantity: 5000; Voltage Rating: 50V; Features: Moisture Resistant; Max Power Dissipation: 100mW; Number of Terminations: 2; Construction: Rectangular; Length: 1.6mm; Width: 0.8mm; Height: 0.45mm; Depth: 0.8mm; Lead Free: Lead Free; RoHS Compliant: Yes; Reach SVHC Compliant: Unknown; Military Standard: Not; Supplier Part Number 1: 311-0.0GRCT-ND; Max Operating Temperature: 155°C
R31 = RES 43K OHM 0603: Res Thick Film 0603 43K Ohm 5% 0.1W(1/10W) ±100ppm/°C Pad SMD T/R; Manufacturer: Yageo; Desinged by: BERKE; Voltage Rating: 75V; Power Rating: 100mW; Voltage Rating (DC): 50V; Supplier 1: Digi-Key; Manufacturer Part Number: RC0603JR-0743KL; RoHS: Yes; Category: Chip SMD Resistors; Stock 1: 306498; Pricing 1: 1=0,1, 10=0,014, 50=0,0088, 100=0,0073, 500=0,00486, 1000=0,00415 (USD); Case/Package: 0603; Case Code (Imperial): 0603; Case Code (Metric): 1608; Weight: 7.1E-05oz; Min Operating Temperature: -55°C; Max Operating Temperature: 155°C; Tolerance: 5%; Packaging: Tape and Reel; Package Quantity: 1; Termination: SMD/SMT; Number of Terminations: 2; Temperature Coefficient: 100ppm/°C; Max Power Dissipation: 100mW; Working Voltage: 75V; Features: Moisture Resistant; Series: RC; Technology: THICK FILM; Length: 0.063inch; Width: 0.031inch; Height: 0.022inch; Lead Free: Lead Free; RoHS Compliant: Yes; ComponentLink1URL: https://datasheet.ciiva.com/2453/pyu-r-int-thick-7-2453053.pdf?src-supplier=Digi-Key; ComponentLink1Description: https://datasheet.ciiva.com/2453/pyu-r-int-thick-7-2453053.pdf?src-supplier=Digi-Key; ComponentLink2URL: https://datasheet.ciiva.com/2453/pyu-r-int-thick-7-2453054.pdf?src-supplier=Digi-Key; ComponentLink2Description: https://datasheet.ciiva.com/2453/pyu-r-int-thick-7-2453054.pdf?src-supplier=Digi-Key; ComponentLink3URL: https://datasheet.ciiva.com/2453/pyu-r-int-thick-7-2453052.pdf?src-supplier=Digi-Key; ComponentLink3Description: https://datasheet.ciiva.com/2453/pyu-r-int-thick-7-2453052.pdf?src-supplier=Digi-Key; Supplier Part Number 1: 311-43KGRCT-ND
R32 = RES 100K OHM 0603: RES SMD 100K OHM 1% 1/10W 0603; Manufacturer: Yageo; Desinged by: BERKE; Temperature Coefficient: 100ppm/°C; Voltage Rating (DC): 50V; Power Rating: 100mW; Supplier 1: Digi-Key; Manufacturer Part Number: RC0603FR-07100KL; RoHS: Yes; Category: Chip SMD Resistors; Stock 1: 6893987; Pricing 1: 1=0,1, 10=0,018, 50=0,0106, 100=0,0088, 500=0,00592, 1000=0,00505 (USD); Case/Package: 0603; Number of Pins: 2; Case Code (Imperial): 0603; Case Code (Metric): 1608; Min Operating Temperature: -55°C; Max Operating Temperature: 155°C; Tolerance: 1%; Resistor Type: Thick Film; Packaging: Tape and Reel; Voltage Rating: 50V; Termination: SMD/SMT; Number of Terminations: 2; Features: Moisture Resistant; Series: RC; Max Power Dissipation: 100mW; Resistance Tolerance: 1%; Construction: Rectangular; Technology: THICK FILM; Length: 1.6mm; Width: 0.8mm; Height: 0.45mm; Depth: 0.8mm; Reach SVHC Compliant: No; Lead Free: Lead Free; Military Standard: Not; RoHS Compliant: Yes; Supplier Part Number 1: 311-100KHRCT-ND
RT1 = TFPT1206L1002FM: Thermistor PTC 10K Ohm 1% 1206; Manufacturer: Vishay Dale; Desinged by: BERKE; Resistance: 10kR; Power Rating: 125mW; Voltage: 40V; Supplier 1: Digi-Key; Manufacturer Part Number: TFPT1206L1002FM; RoHS: Yes; Category: Thermistors; Stock 1: 3560; Pricing 1: 1=0,43, 10=0,413 (USD); Mount: Surface Mount; Case/Package: 1206; Case Code (Imperial): 1206; Min Operating Temperature: -55°C; Max Operating Temperature: 125°C; Packaging: Tape and Reel; Package Quantity: 5000; Tolerance: 1%; Max Power Dissipation: 125mW; Termination: SMD/SMT; Series: TFPT; Resistance Tolerance: 1%; Length: 3.2mm; Width: 1.6mm; Height: 0.55mm; Lead Free: Lead Free; RoHS Compliant: Yes; ComponentLink1URL: https://datasheet.ciiva.com/2852/tfpt-2852076.pdf?src-supplier=Digi-Key; ComponentLink1Description: https://datasheet.ciiva.com/2852/tfpt-2852076.pdf?src-supplier=Digi-Key; Supplier Part Number 1: 541-3533-1-ND
S1 = LHI 878/3902: SENSOR PYRO DETECTOR DUAL MOTION; Desinged by: BERKE; Max. Supply Voltage: 12; Mib. Supply Voltage: 2; Type: Pyro Detector; Supplier1: Digi-Key; Supplier Part Number: 1601-LHI878/3902-ND; Case/Package: LHI
U8 = NCS36000: PIR CONTROLLER NCS36000 Series Single 5.75V Passive Infrared Detector Controller (PIR) -SOIC-14; Manufacturer: ON Semiconductor; Desinged by: BERKE; Operating Supply Current: 50uA; Quiescent Current: 20uA; Min Supply Voltage: 3V; Output Type: Digital; Supplier 1: Digi-Key; Manufacturer Part Number: NCS36000DRG; RoHS: Yes; Category: Amplifiers - Op Amps, Buffer, Instrumentation; Stock 1: 18631; Pricing 1: 1=1, 10=0,89, 25=0,8444, 100=0,6484, 250=0,573, 500=0,54286, 1000=0,42222 (USD); Case/Package: SOIC; Number of Pins: 14; Min Operating Temperature: -40°C; Max Operating Temperature: 85°C; Package Quantity: 3000; Packaging: Tape and Reel; Max Supply Voltage: 5.75V; Series: -; Input Type: DIGITAL; Length: 8.75mm; Width: 4mm; Height: 1.5mm; Radiation Hardening: No; Reach SVHC Compliant: No; Lead Free: Lead Free; Halogen Free: Halogen Free; RoHS Compliant: Yes; ComponentLink1URL: https://datasheet.ciiva.com/1781/ncs36000-d-1781637.pdf?src-supplier=Digi-Key; ComponentLink1Description: https://datasheet.ciiva.com/1781/ncs36000-d-1781637.pdf?src-supplier=Digi-Key; ComponentLink2URL: https://datasheet.ciiva.com/4763/ncs36000-d-89569-4763639.pdf?src-supplier=Mouser; ComponentLink2Description: https://datasheet.ciiva.com/4763/ncs36000-d-89569-4763639.pdf?src-supplier=Mouser; ComponentLink3URL: https://datasheet.ciiva.com/1781/ncs36000-d-1781638.pdf?src-supplier=Digi-Key; ComponentLink3Description: https://datasheet.ciiva.com/1781/ncs36000-d-1781638.pdf?src-supplier=Digi-Key; ComponentLink4URL: https://datasheet.ciiva.com/1781/ncs36000-d-1781639.pdf?src-supplier=Digi-Key; ComponentLink4Description: https://datasheet.ciiva.com/1781/ncs36000-d-1781639.pdf?src-supplier=Digi-Key; ComponentLink5URL: https://datasheet.ciiva.com/2965/ncs36000-d-2965212.pdf?src-supplier=Avnet; ComponentLink5Description: https://datasheet.ciiva.com/2965/ncs36000-d-2965212.pdf?src-supplier=Avnet; ComponentLink6URL: https://datasheet.ciiva.com/2966/ncs36000-d-2966525.pdf?src-supplier=Avnet; ComponentLink6Description: https://datasheet.ciiva.com/2966/ncs36000-d-2966525.pdf?src-supplier=Avnet; Supplier Part Number 1: NCS36000DRGOSCT-ND

## Nets that join several sheets
3.3VDC: Power Management (8 pins), MicroController (26 pins)
5VDC: Power Management (9 pins), MicroController (BZ1.2 C32.2)
GND: Power Management (27 pins), MicroController (34 pins)
LED_DRIVER: Power Management (J7.3), MicroController (U5.21)
NetJ7_5: Power Management (J7.5), MicroController (U5.22)
NetR2_1: Power Management (R2.1), MicroController (U5.41)
NetR3_1: Power Management (R3.1), MicroController (U5.40)
SWCLK: Power Management (j6.3), MicroController (U5.37)
SWDIO: Power Management (j6.2), MicroController (U5.34)
TDI: Power Management (j6.4), MicroController (U5.38)
TEMPERATURE_ADC: Power Management (J7.4), MicroController (U5.19)
USB_N: Power Management (USB1.2), MicroController (R6.2 U4.1 U4.6)
USB_P: Power Management (USB1.3), MicroController (R7.2 U4.3 U4.4)